# EAGLE design backpack_v1.1 (EAGLE 6.6.0)
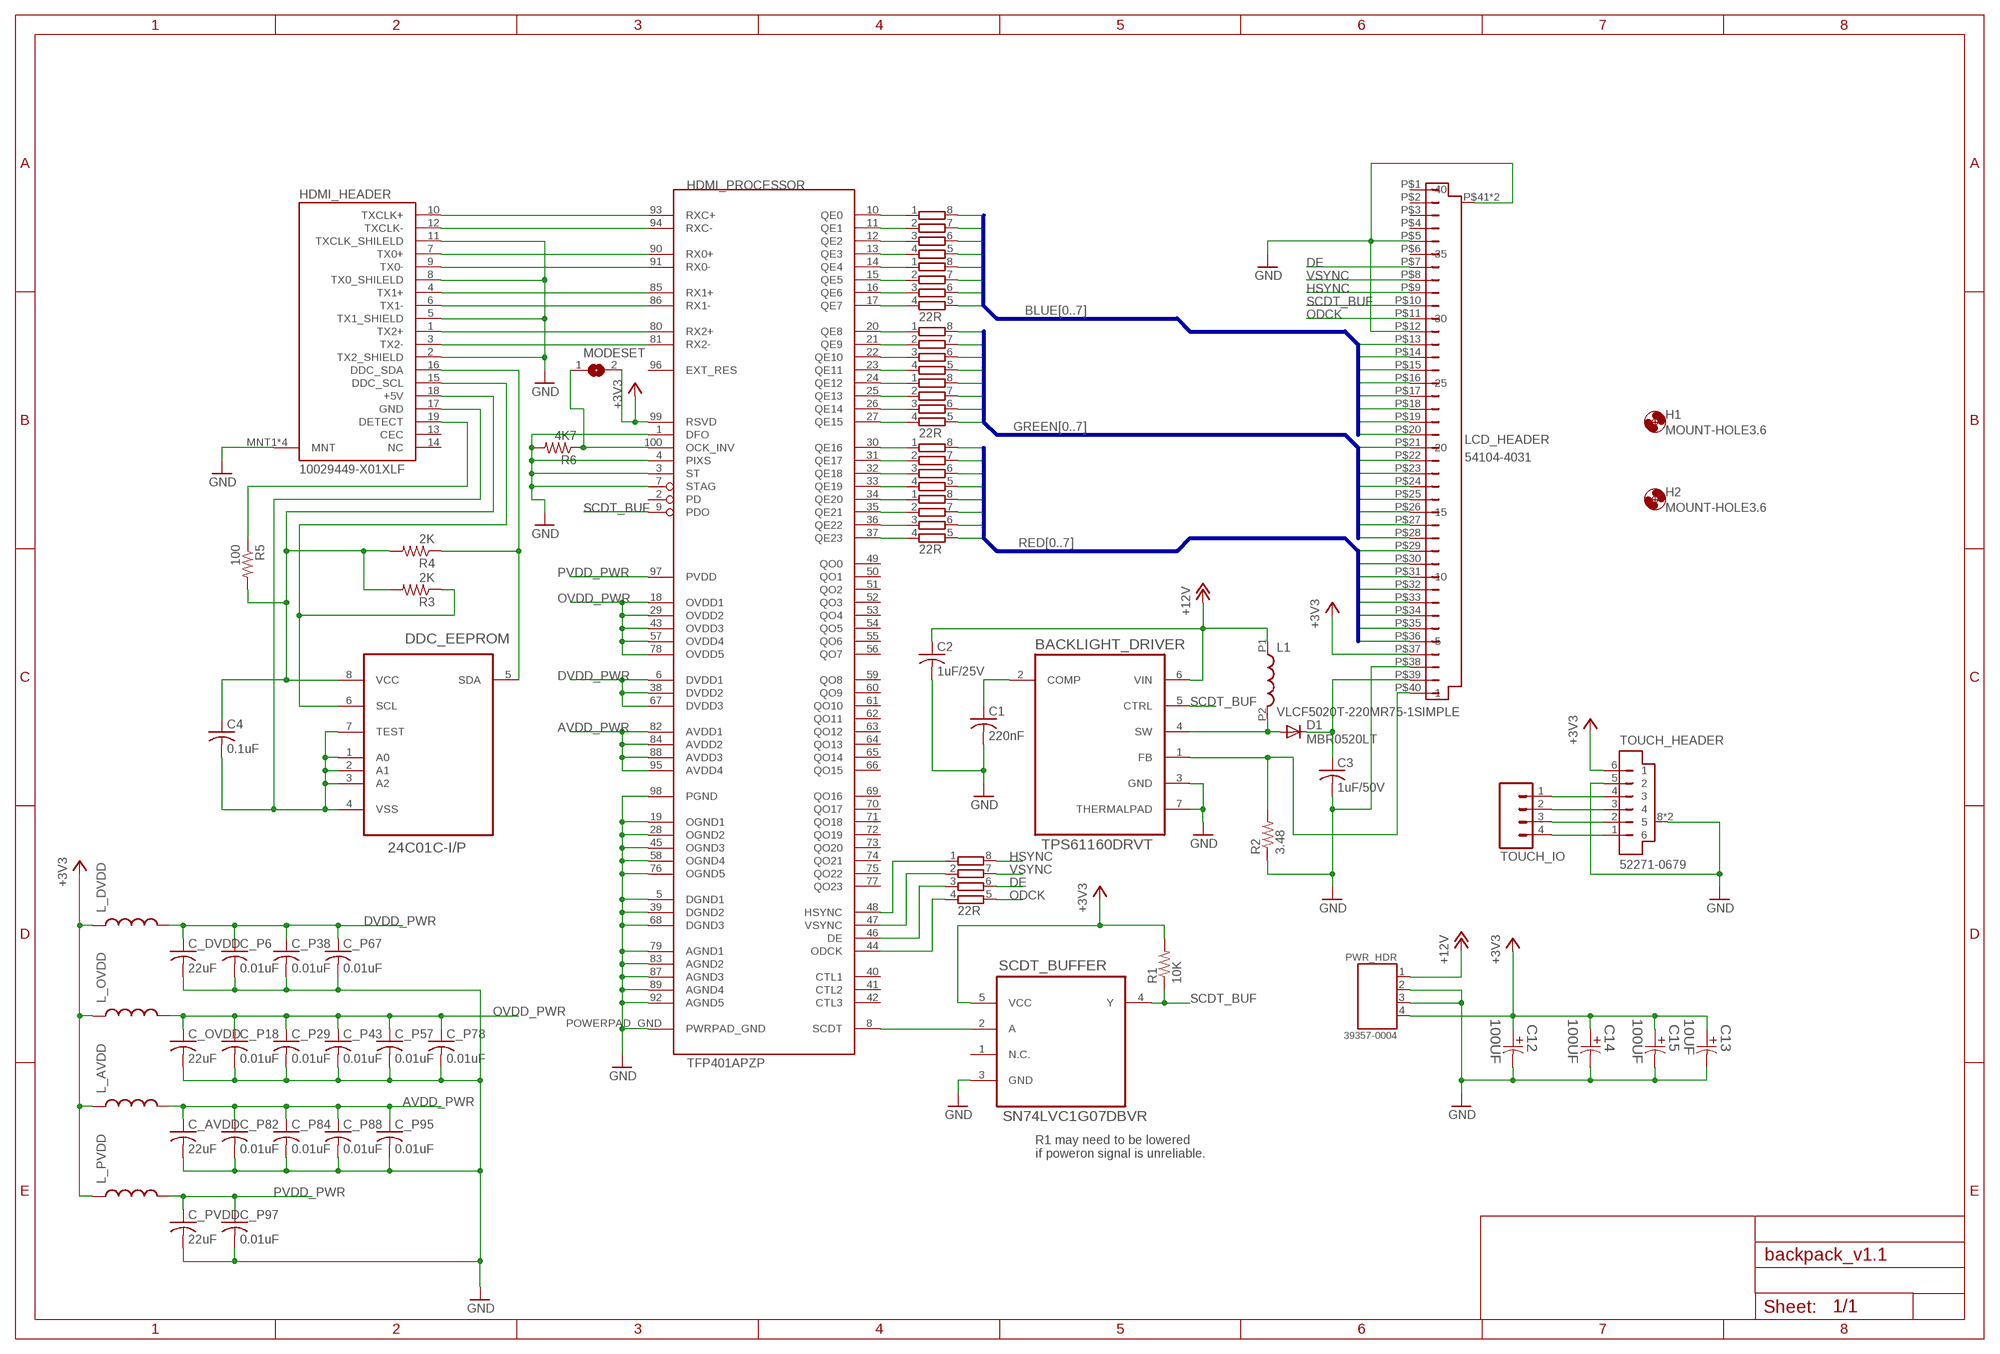
[diagram p0: schematic, sheet 1]

## Parts
BACKLIGHT_DRIVER  TPS61160DRVT  [SON65P210X210X80-7N]
C1  220nF  C-USC0805  [C0805]
C2  1uF/25V  C-USC0603  [C0603]
C3  1uF/50V  C-USC0805  [C0805]
C4  0.1uF  C-USC0603  [C0603]
C12  100UF  ECE-A1CKS101-D8XP3.5  [CAPPR350-800X1150]
C13  10UF  ECE-A1CKS100-D4XP1.5  [CAPPR150-400X700]
C14  100UF  ECE-A1CKS101-D8XP3.5  [CAPPR350-800X1150]
C15  100UF  ECE-A1CKS101-D8XP3.5  [CAPPR350-800X1150]
C_AVDD  22uF  C-USC0603  [C0603]
C_DVDD  22uF  C-USC0603  [C0603]
C_OVDD  22uF  C-USC0603  [C0603]
C_P6  0.01uF  C-USC0603  [C0603]
C_P18  0.01uF  C-USC0603  [C0603]
C_P29  0.01uF  C-USC0603  [C0603]
C_P38  0.01uF  C-USC0603  [C0603]
C_P43  0.01uF  C-USC0603  [C0603]
C_P57  0.01uF  C-USC0603  [C0603]
C_P67  0.01uF  C-USC0603  [C0603]
C_P78  0.01uF  C-USC0603  [C0603]
C_P82  0.01uF  C-USC0603  [C0603]
C_P84  0.01uF  C-USC0603  [C0603]
C_P88  0.01uF  C-USC0603  [C0603]
C_P95  0.01uF  C-USC0603  [C0603]
C_P97  0.01uF  C-USC0603  [C0603]
C_PVDD  22uF  C-USC0603  [C0603]
D1  MBR0520LT  [SOD123]
DDC_EEPROM  24C01C-I/P  [DIP254P762X533-8]
H1  MOUNT-HOLE3.6  [3,6]
H2  MOUNT-HOLE3.6  [3,6]
HDMI_HEADER  10029449-X01XLF  [10029449]
HDMI_PROCESSOR  TFP401APZP  [100-TQFP(PZP)]
L1  VLCF5020T-220MR75-1SIMPLE  [VLCF5020-1_SIMPLE]
L_AVDD  INDUCTOR0603  [0603]
L_DVDD  INDUCTOR0603  [0603]
L_OVDD  INDUCTOR0603  [0603]
L_PVDD  INDUCTOR0603  [0603]
LCD_HEADER  54104-4031  [54104-4031]
MODESET  SJ  [SJ]
PWR_HDR  39357-0004  [39357-0004]
R1  10K  R-US_R0805  [R0805]
R2  3.48  R-US_R0805  [R0805]
R3  2K  R-US_R0805  [R0805]
R4  2K  R-US_R0805  [R0805]
R5  100  R-US_R0805  [R0805]
R6  4K7  R-US_R0805  [R0805]
RN1  22R  4R-NCAY16  [CAY16]
RN2  22R  4R-NCAY16  [CAY16]
RN3  22R  4R-NCAY16  [CAY16]
RN4  22R  4R-NCAY16  [CAY16]
RN5  22R  4R-NCAY16  [CAY16]
RN6  22R  4R-NCAY16  [CAY16]
RN7  22R  4R-NCAY16  [CAY16]
SCDT_BUFFER  SN74LVC1G07DBVR  [SOT95P280X145-5N]
TOUCH_HEADER  52271-0679  [52271-0679]
TOUCH_IO  M04POLAR  [MOLEX-1X4]

## Nets
+3V3: C12.1 C13.1 C14.1 C15.1 HDMI_PROCESSOR.99(RSVD) L_AVDD.1 L_DVDD.1 L_OVDD.1 L_PVDD.1 LCD_HEADER.P$37 MODESET.2 PWR_HDR.4 R1.2 SCDT_BUFFER.5(VCC) TOUCH_HEADER.6
+5V: C4.1 DDC_EEPROM.8(VCC) HDMI_HEADER.18(+5V) R3.2 R4.2 R5.2
+12V: BACKLIGHT_DRIVER.6(VIN) C2.1 L1.P1 PWR_HDR.1
AVDD_PWR: C_AVDD.1 C_P82.1 C_P84.1 C_P88.1 C_P95.1 HDMI_PROCESSOR.82(AVDD1) HDMI_PROCESSOR.84(AVDD2) HDMI_PROCESSOR.88(AVDD3) HDMI_PROCESSOR.95(AVDD4) L_AVDD.2
BLUE0: LCD_HEADER.P$20 RN1.8
BLUE1: LCD_HEADER.P$19 RN1.7
BLUE2: LCD_HEADER.P$18 RN1.6
BLUE3: LCD_HEADER.P$17 RN1.5
BLUE4: LCD_HEADER.P$16 RN2.8
BLUE5: LCD_HEADER.P$15 RN2.7
BLUE6: LCD_HEADER.P$14 RN2.6
BLUE7: LCD_HEADER.P$13 RN2.5
DDC_SCL: DDC_EEPROM.6(SCL) HDMI_HEADER.15(DDC_SCL) R3.1
DDC_SDA: DDC_EEPROM.5(SDA) HDMI_HEADER.16(DDC_SDA) R4.1
DE: LCD_HEADER.P$7 RN7.6
DVDD_PWR: C_DVDD.1 C_P6.1 C_P38.1 C_P67.1 HDMI_PROCESSOR.6(DVDD1) HDMI_PROCESSOR.38(DVDD2) HDMI_PROCESSOR.67(DVDD3) L_DVDD.2
GND: BACKLIGHT_DRIVER.3(GND) BACKLIGHT_DRIVER.7(THERMALPAD) C1.2 C2.2 C3.2 C12.2 C13.2 C14.2 C15.2 C_AVDD.2 C_DVDD.2 C_OVDD.2 C_P6.2 C_P18.2 C_P29.2 C_P38.2 C_P43.2 C_P57.2 C_P67.2 C_P78.2 C_P82.2 C_P84.2 C_P88.2 C_P95.2 C_P97.2 C_PVDD.2 HDMI_HEADER.2(TX2_SHIELD) HDMI_HEADER.5(TX1_SHIELD) HDMI_HEADER.8(TX0_SHILELD) HDMI_HEADER.11(TXCLK_SHILELD) HDMI_HEADER.MNT1(MNT) HDMI_HEADER.MNT2(MNT) HDMI_HEADER.MNT3(MNT) HDMI_HEADER.MNT4(MNT) HDMI_PROCESSOR.1(DFO) HDMI_PROCESSOR.3(ST) HDMI_PROCESSOR.4(PIXS) HDMI_PROCESSOR.5(DGND1) HDMI_PROCESSOR.7(STAG) HDMI_PROCESSOR.19(OGND1) HDMI_PROCESSOR.28(OGND2) HDMI_PROCESSOR.39(DGND2) HDMI_PROCESSOR.45(OGND3) HDMI_PROCESSOR.58(OGND4) HDMI_PROCESSOR.68(DGND3) HDMI_PROCESSOR.76(OGND5) HDMI_PROCESSOR.79(AGND1) HDMI_PROCESSOR.83(AGND2) HDMI_PROCESSOR.87(AGND3) HDMI_PROCESSOR.89(AGND4) HDMI_PROCESSOR.92(AGND5) HDMI_PROCESSOR.98(PGND) HDMI_PROCESSOR.POWERPAD_GND(PWRPAD_GND) LCD_HEADER.P$5 LCD_HEADER.P$12 LCD_HEADER.P$38 LCD_HEADER.P$41(GND) LCD_HEADER.P$42(GND) PWR_HDR.2 PWR_HDR.3 R2.1 R6.2 SCDT_BUFFER.3(GND) TOUCH_HEADER.5 TOUCH_HEADER.8(GND) TOUCH_HEADER.9(GND)
GREEN0: LCD_HEADER.P$28 RN3.8
GREEN1: LCD_HEADER.P$27 RN3.7
GREEN2: LCD_HEADER.P$26 RN3.6
GREEN3: LCD_HEADER.P$25 RN3.5
GREEN4: LCD_HEADER.P$24 RN4.8
GREEN5: LCD_HEADER.P$23 RN4.7
GREEN6: LCD_HEADER.P$22 RN4.6
GREEN7: LCD_HEADER.P$21 RN4.5
HDMI_DETECT: HDMI_HEADER.19(DETECT) R5.1
HDMI_GND: C4.2 DDC_EEPROM.1(A0) DDC_EEPROM.2(A1) DDC_EEPROM.3(A2) DDC_EEPROM.4(VSS) DDC_EEPROM.7(TEST) HDMI_HEADER.17(GND)
HSYNC: LCD_HEADER.P$9 RN7.8
N$1: HDMI_PROCESSOR.10(QE0) RN1.1
N$2: HDMI_PROCESSOR.11(QE1) RN1.2
N$3: HDMI_PROCESSOR.12(QE2) RN1.3
N$4: HDMI_PROCESSOR.13(QE3) RN1.4
N$5: HDMI_PROCESSOR.14(QE4) RN2.1
N$6: HDMI_PROCESSOR.15(QE5) RN2.2
N$7: HDMI_PROCESSOR.16(QE6) RN2.3
N$8: HDMI_PROCESSOR.17(QE7) RN2.4
N$9: HDMI_PROCESSOR.20(QE8) RN3.1
N$10: HDMI_PROCESSOR.21(QE9) RN3.2
N$11: HDMI_PROCESSOR.22(QE10) RN3.3
N$12: HDMI_PROCESSOR.23(QE11) RN3.4
N$13: HDMI_PROCESSOR.24(QE12) RN4.1
N$14: HDMI_PROCESSOR.25(QE13) RN4.2
N$15: HDMI_PROCESSOR.26(QE14) RN4.3
N$16: HDMI_PROCESSOR.27(QE15) RN4.4
N$17: HDMI_PROCESSOR.30(QE16) RN5.1
N$18: HDMI_PROCESSOR.31(QE17) RN5.2
N$19: HDMI_PROCESSOR.32(QE18) RN5.3
N$20: HDMI_PROCESSOR.33(QE19) RN5.4
N$21: HDMI_PROCESSOR.34(QE20) RN6.1
N$22: HDMI_PROCESSOR.35(QE21) RN6.2
N$23: HDMI_PROCESSOR.36(QE22) RN6.3
N$24: HDMI_PROCESSOR.37(QE23) RN6.4
N$25: BACKLIGHT_DRIVER.4(SW) D1.A L1.P2
N$26: BACKLIGHT_DRIVER.2(COMP) C1.1
N$27: BACKLIGHT_DRIVER.1(FB) LCD_HEADER.P$40 R2.2
N$28: HDMI_PROCESSOR.44(ODCK) RN7.4
N$29: C3.1 D1.C LCD_HEADER.P$39
N$30: HDMI_PROCESSOR.46(DE) RN7.3
N$31: HDMI_PROCESSOR.47(VSYNC) RN7.2
N$32: HDMI_PROCESSOR.48(HSYNC) RN7.1
N$33: TOUCH_HEADER.4 TOUCH_IO.1
N$34: TOUCH_HEADER.3 TOUCH_IO.2
N$35: TOUCH_HEADER.2 TOUCH_IO.3
N$36: TOUCH_HEADER.1 TOUCH_IO.4
OCK_INV: HDMI_PROCESSOR.100(OCK_INV) MODESET.1 R6.1
ODCK: LCD_HEADER.P$11 RN7.5
OVDD_PWR: C_OVDD.1 C_P18.1 C_P29.1 C_P43.1 C_P57.1 C_P78.1 HDMI_PROCESSOR.18(OVDD1) HDMI_PROCESSOR.29(OVDD2) HDMI_PROCESSOR.43(OVDD3) HDMI_PROCESSOR.57(OVDD4) HDMI_PROCESSOR.78(OVDD5) L_OVDD.2
PVDD_PWR: C_P97.1 C_PVDD.1 HDMI_PROCESSOR.97(PVDD) L_PVDD.2
RED0: LCD_HEADER.P$36 RN5.8
RED1: LCD_HEADER.P$35 RN5.7
RED2: LCD_HEADER.P$34 RN5.6
RED3: LCD_HEADER.P$33 RN5.5
RED4: LCD_HEADER.P$32 RN6.8
RED5: LCD_HEADER.P$31 RN6.7
RED6: LCD_HEADER.P$30 RN6.6
RED7: LCD_HEADER.P$29 RN6.5
SCDT: HDMI_PROCESSOR.8(SCDT) SCDT_BUFFER.2(A)
SCDT_BUF: BACKLIGHT_DRIVER.5(CTRL) HDMI_PROCESSOR.9(PDO) LCD_HEADER.P$10 R1.1 SCDT_BUFFER.4(Y)
TX0_N: HDMI_HEADER.9(TX0-) HDMI_PROCESSOR.91(RX0-)
TX0_P: HDMI_HEADER.7(TX0+) HDMI_PROCESSOR.90(RX0+)
TX1_N: HDMI_HEADER.6(TX1-) HDMI_PROCESSOR.86(RX1-)
TX1_P: HDMI_HEADER.4(TX1+) HDMI_PROCESSOR.85(RX1+)
TX2_N: HDMI_HEADER.3(TX2-) HDMI_PROCESSOR.81(RX2-)
TX2_P: HDMI_HEADER.1(TX2+) HDMI_PROCESSOR.80(RX2+)
TXCLK_N: HDMI_HEADER.12(TXCLK-) HDMI_PROCESSOR.94(RXC-)
TXCLK_P: HDMI_HEADER.10(TXCLK+) HDMI_PROCESSOR.93(RXC+)
VSYNC: LCD_HEADER.P$8 RN7.7
Unconnected: HDMI_HEADER.13(CEC) HDMI_HEADER.14(NC) HDMI_PROCESSOR.2(PD) HDMI_PROCESSOR.40(CTL1) HDMI_PROCESSOR.41(CTL2) HDMI_PROCESSOR.42(CTL3) HDMI_PROCESSOR.49(QO0) HDMI_PROCESSOR.50(QO1) HDMI_PROCESSOR.51(QO2) HDMI_PROCESSOR.52(QO3) HDMI_PROCESSOR.53(QO4) HDMI_PROCESSOR.54(QO5) HDMI_PROCESSOR.55(QO6) HDMI_PROCESSOR.56(QO7) HDMI_PROCESSOR.59(QO8) HDMI_PROCESSOR.60(QO9) HDMI_PROCESSOR.61(QO10) HDMI_PROCESSOR.62(QO11) HDMI_PROCESSOR.63(QO12) HDMI_PROCESSOR.64(QO13) HDMI_PROCESSOR.65(QO14) HDMI_PROCESSOR.66(QO15) HDMI_PROCESSOR.69(QO16) HDMI_PROCESSOR.70(QO17) HDMI_PROCESSOR.71(QO18) HDMI_PROCESSOR.72(QO19) HDMI_PROCESSOR.73(QO20) HDMI_PROCESSOR.74(QO21) HDMI_PROCESSOR.75(QO22) HDMI_PROCESSOR.77(QO23) HDMI_PROCESSOR.96(EXT_RES) LCD_HEADER.P$1 LCD_HEADER.P$2 LCD_HEADER.P$3 LCD_HEADER.P$4 LCD_HEADER.P$6 SCDT_BUFFER.1(N.C.)

## Buses
BLUE[0..7]
GREEN[0..7]
RED[0..7]

## Notes on the sheet
- R1 may need to be lowered 
  if poweron signal is unreliable.

## Library data of the parts
BACKLIGHT_DRIVER = newark-TI-TPS61160:TPS61160DRVT: White LED Driver With Digital and PWM Brightness Control in 2mm x 2mm QFN Package for up to 10 LEDs in Series; MPN: TPS61160DRVT; OC_FARNELL: 1603420; OC_NEWARK: 65M6336; PACKAGE: SON-6; SUPPLIER: Texas Instruments
C1-C4 C_AVDD C_DVDD C_OVDD C_P6 C_P18 C_P29 C_P38 C_P43 C_P57 C_P67 C_P78 C_P82 C_P84 C_P88 C_P95 C_P97 C_PVDD = resistor:C-US: CAPACITOR, American symbol
C12 C14 C15 = newark-Panasonic-ECE:ECE-: Aluminum Electrolytic Capacitors/Radial Lead Type; MPN: ECE-A1CKS101; OC_FARNELL: 1902001; OC_NEWARK: 55T0219; PACKAGE: Radial Lead-TH; SUPPLIER: PANASONIC; TOLERANCE: ±20 %; VOLTAGERATING: 16V
C13 = newark-Panasonic-ECE:ECE-: Aluminum Electrolytic Capacitors/Radial Lead Type; MPN: ECE-A1CKS100; OC_FARNELL: 1901997; OC_NEWARK: 55T0218; PACKAGE: Radial Lead-TH; SUPPLIER: PANASONIC; TOLERANCE: ±20 %; VOLTAGERATING: 16V
D1 = diode:MBR0520LT: SCHOTTKY BARRIER RECTIFIER Source: http://onsemi.com .. MBR0520LT1-D.pdf
DDC_EEPROM = newark-Microchip-24C01CIP:24C01C-I/P: IC EEPROM 1KBIT 400KHZ,DIP-8; MPN: 24C01C-I/P; OC_FARNELL: 1847800; OC_NEWARK: 92C6948; PACKAGE: DIP-8; SUPPLIER: Microchip
H1 H2 = holes:MOUNT-HOLE: MOUNTING HOLE with drill center marker
HDMI_HEADER = ccbtech-FCI:10029449-X01XLF
HDMI_PROCESSOR = ccbtech-TI:TFP401A
L1 = ccbtech-TDK:VLCF5020T-220MR75-1
L_AVDD L_DVDD L_OVDD L_PVDD = SparkFun-Passives:INDUCTOR: Inductors Basic Inductor/Choke - 0603 and 1206. Footprints are not proven and vary greatly between part numbers.
LCD_HEADER = ccbtech-Molex:54104-4031
MODESET = jumper:SJ: SMD solder JUMPER
PWR_HDR = ccbtech-Molex:39357-0004
R1-R6 = resistor:R-US_: RESISTOR, American symbol
RN1-RN7 = resistor-dil:4R-N: Array Chip Resistor Source: RS Component / Phycomp; OC_FARNELL: unknown; OC_NEWARK: unknown
SCDT_BUFFER = newark-TI-SN74LVC1G07:SN74LVC1G07DBVR: SINGLE BUFFER/DRIVER WITH OPEN-DRAIN OUTPUT; MPN: SN74LVC1G07DBVR; OC_FARNELL: 1102969; OC_NEWARK: 39C2931; PACKAGE: SOT-23-5; SUPPLIER: Texas Instruments
TOUCH_HEADER = ccbtech-Molex:52271-0679
TOUCH_IO = SparkFun-Connectors:M04: Header 4 Standard 4-pin 0.1" header. Use with straight break away headers (SKU : PRT-00116), right angle break away headers (PRT-00553), swiss pins (PRT-00743), machine pins (PRT-00117), and female headers (PRT-00115). Molex polarized connector foot print use with SKU : PRT-08231 with associated crimp pins and housings. 1MM SMD Version SKU: PRT-10208

## Board
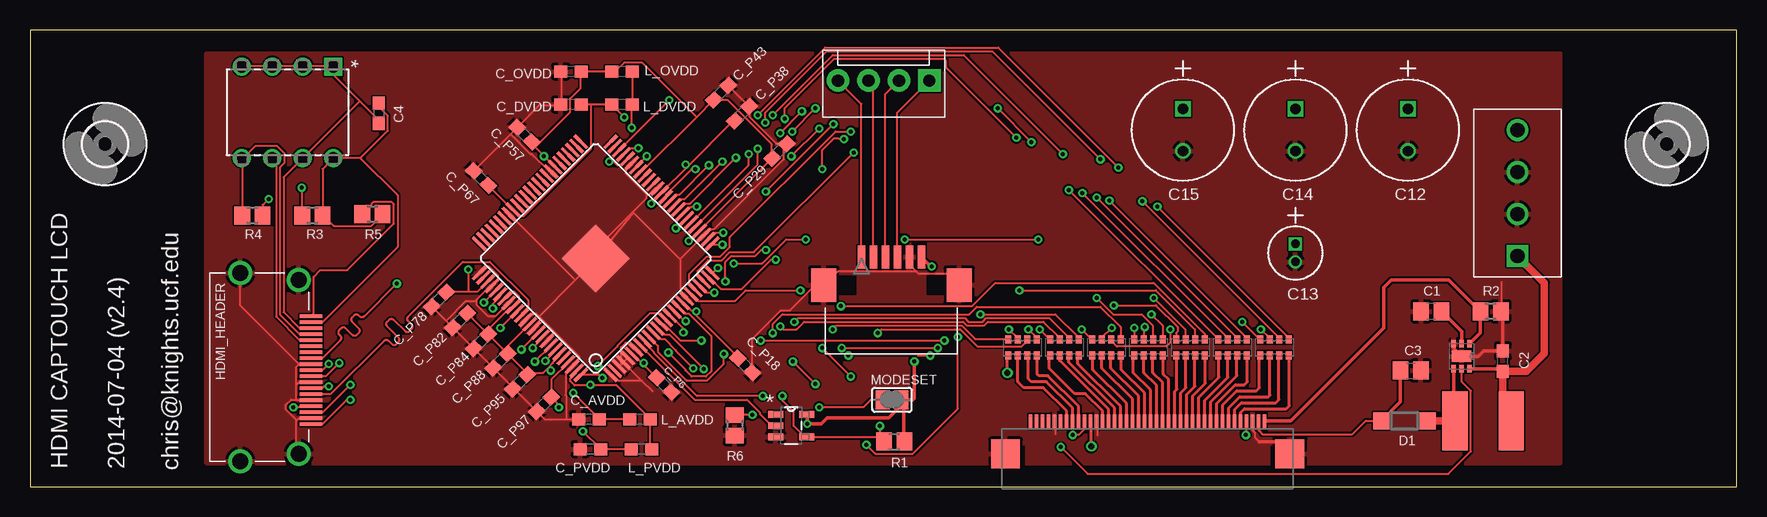
[diagram p1: board, top side]
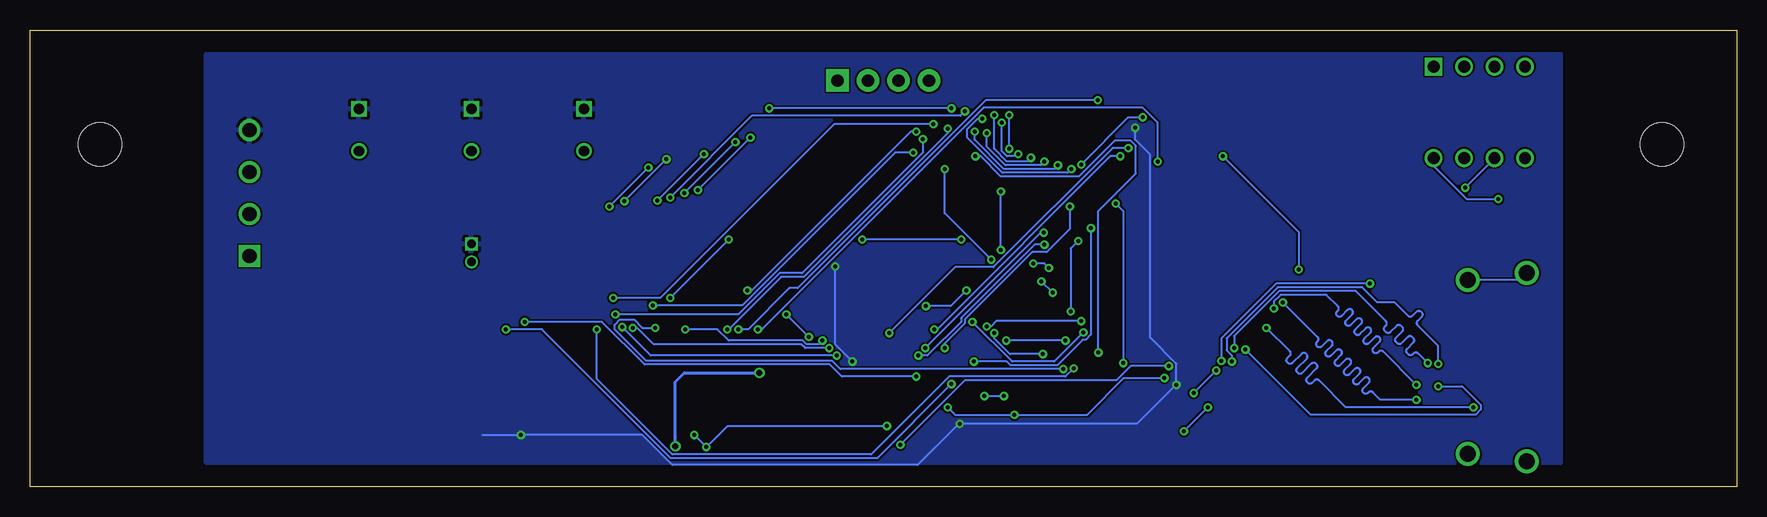
[diagram p2: board, bottom side, seen from below]

Size 142.24 x 38.1 mm. Coordinates in mm from the lower left corner, seen from the top.
Outline: 0,0 142.24,0 142.24,38.1 0,38.1 0,0
Copper layers (1*16): Top 0.0356mm / dielectric 1.5011mm / Bottom 0.0356mm
Design rules "LaenPCBOrder": minimum track width 6mil, minimum drill 13mil, track to track 6mil, track to pad 6mil, pad to pad 6mil, via to via 6mil, smd to smd 6mil, copper to edge 15mil, drill to drill 6mil, minimum pad ring 7mil, minimum via ring 7mil, stop-mask expansion 3mil, vias tented up to drill 0mil, thermal gap 10mil

### Footprints (pad centres in the part's own frame; a part is rotated, then mirrored left to right if it is on the bottom)
SON65P210X210X80-7N = smd 0.61 x 0.356: 1 -1.041,0.66; 2 -1.041,0; 3 -1.041,-0.66; 4 1.041,-0.66; 5 1.041,0; 6 1.041,0.66 | smd 0.991 x 1.6: 7 0,0
C0805 = smd 1.3 x 1.5: 1 -0.85,0; 2 0.85,0
C0603 = smd 1.1 x 1: 1 -0.85,0; 2 0.85,0
CAPPR350-800X1150 = drill 0.864 square: 1 -3.505,0 | drill 0.864: 2 0,0
CAPPR150-400X700 = drill 0.711 square: 1 -1.499,0 | drill 0.711: 2 0,0
SOD123 = smd 1.4 x 1.4: A 1.9,0; C -1.9,0
DIP254P762X533-8 = drill 0.991 square: 1 -7.62,7.62 | drill 0.991: 2 -7.62,5.08; 3 -7.62,2.54; 4 -7.62,0; 5 0,0; 6 0,2.54; 7 0,5.08; 8 0,7.62
3,6 = hole 3.6: 0,0
10029449 = smd 0.3 x 1.9: 1 4.75,0.95; 2 4.25,0.95; 3 3.75,0.95; 4 3.25,0.95; 5 2.75,0.95; 6 2.25,0.95; 7 1.75,0.95; 8 1.25,0.95; 9 0.75,0.95; 10 0.25,0.95; 11 -0.25,0.95; 12 -0.75,0.95; 13 -1.25,0.95; 14 -1.75,0.95; 15 -2.25,0.95; 16 -2.75,0.95; 17 -3.25,0.95; 18 -3.75,0.95; 19 -4.25,0.95 | drill 1.33: MNT1 -7.25,-0.05; MNT2 -7.85,-4.95; MNT3 7.85,-4.95; MNT4 7.25,-0.05
100-TQFP(PZP) = smd 0.27 x 1.5: 1 -6,-7.75; 2 -5.5,-7.75; 3 -5,-7.75; 4 -4.5,-7.75; 5 -4,-7.75; 6 -3.5,-7.75; 7 -3,-7.75; 8 -2.5,-7.75; 9 -2,-7.75; 10 -1.5,-7.75; 11 -1,-7.75; 12 -0.5,-7.75; 13 0,-7.75; 14 0.5,-7.75; 15 1,-7.75; 16 1.5,-7.75; 17 2,-7.75; 18 2.5,-7.75; 19 3,-7.75; 20 3.5,-7.75; 21 4,-7.75; 22 4.5,-7.75; 23 5,-7.75; 24 5.5,-7.75; 25 6,-7.75; 51 6,7.75; 52 5.5,7.75; 53 5,7.75; 54 4.5,7.75; 55 4,7.75; 56 3.5,7.75; 57 3,7.75; 58 2.5,7.75; 59 2,7.75; 60 1.5,7.75; 61 1,7.75; 62 0.5,7.75; 63 0,7.75; 64 -0.5,7.75; 65 -1,7.75; 66 -1.5,7.75; 67 -2,7.75; 68 -2.5,7.75; 69 -3,7.75; 70 -3.5,7.75; 71 -4,7.75; 72 -4.5,7.75; 73 -5,7.75; 74 -5.5,7.75; 75 -6,7.75 | smd 1.5 x 0.27: 26 7.75,-6; 27 7.75,-5.5; 28 7.75,-5; 29 7.75,-4.5; 30 7.75,-4; 31 7.75,-3.5; 32 7.75,-3; 33 7.75,-2.5; 34 7.75,-2; 35 7.75,-1.5; 36 7.75,-1; 37 7.75,-0.5; 38 7.75,0; 39 7.75,0.5; 40 7.75,1; 41 7.75,1.5; 42 7.75,2; 43 7.75,2.5; 44 7.75,3; 45 7.75,3.5; 46 7.75,4; 47 7.75,4.5; 48 7.75,5; 49 7.75,5.5; 50 7.75,6; 76 -7.75,6; 77 -7.75,5.5; 78 -7.75,5; 79 -7.75,4.5; 80 -7.75,4; 81 -7.75,3.5; 82 -7.75,3; 83 -7.75,2.5; 84 -7.75,2; 85 -7.75,1.5; 86 -7.75,1; 87 -7.75,0.5; 88 -7.75,0; 89 -7.75,-0.5; 90 -7.75,-1; 91 -7.75,-1.5; 92 -7.75,-2; 93 -7.75,-2.5; 94 -7.75,-3; 95 -7.75,-3.5; 96 -7.75,-4; 97 -7.75,-4.5; 98 -7.75,-5; 99 -7.75,-5.5; 100 -7.75,-6 | smd 4 x 4: POWERPAD_GND 0,0
VLCF5020-1_SIMPLE = smd 4.9 x 2.1: P1 0,2.35; P2 0,-2.35
0603 = smd 1.1 x 1: 1 -0.85,0; 2 0.85,0
54104-4031 = smd 0.3 x 1.2: P$1 0,-0.603; P$2 0.5,-0.603; P$3 1,-0.603; P$4 1.5,-0.603; P$5 2,-0.603; P$6 2.5,-0.603; P$7 3,-0.603; P$8 3.5,-0.603; P$9 4,-0.603; P$10 4.5,-0.603; P$11 5,-0.603; P$12 5.5,-0.603; P$13 6,-0.603; P$14 6.5,-0.603; P$15 7,-0.603; P$16 7.5,-0.603; P$17 8,-0.603; P$18 8.5,-0.603; P$19 9,-0.603; P$20 9.5,-0.603; P$21 10,-0.603; P$22 10.5,-0.603; P$23 11,-0.603; P$24 11.5,-0.603; P$25 12,-0.603; P$26 12.5,-0.603; P$27 13,-0.603; P$28 13.5,-0.603; P$29 14,-0.603; P$30 14.5,-0.603; P$31 15,-0.603; P$32 15.5,-0.603; P$33 16,-0.603; P$34 16.5,-0.603; P$35 17,-0.603; P$36 17.5,-0.603; P$37 18,-0.603; P$38 18.5,-0.603; P$39 19,-0.603; P$40 19.5,-0.603 | smd 2.4 x 2.4: P$41 -2.1,-3.303; P$42 21.6,-3.303
SJ = smd 1.168 x 1.6: 1 -0.762,0; 2 0.762,0
39357-0004 = drill 1.2 square: 1 5.25,0 | drill 1.2: 2 1.75,0; 3 -1.75,0; 4 -5.25,0
R0805 = smd 1.3 x 1.5: 1 -0.85,0; 2 0.85,0
CAY16 = smd 0.5 x 0.65: 1 -1.2,-0.675; 2 -0.4,-0.675; 3 0.4,-0.675; 4 1.2,-0.675; 5 1.2,0.675; 6 0.4,0.675; 7 -0.4,0.675; 8 -1.2,0.675
SOT95P280X145-5N = smd 1.27 x 0.559: 1 -1.295,0.94; 2 -1.295,0; 3 -1.295,-0.94; 4 1.295,-0.94; 5 1.295,0.94
52271-0679 = smd 0.6 x 1.9: 1 0,0.938; 2 -1,0.938; 3 -2,0.938; 4 -3,0.938; 5 -4,0.938; 6 -5,0.938 | smd 2.1 x 2.8: 8 -8.15,3.288; 9 3.15,3.288
MOLEX-1X4 = drill 1.016 pad 1.88 square: 1 0,0 | drill 1.016 pad 1.88: 2 2.54,0; 3 5.08,0; 4 7.62,0

### Placement (x,y rotation side)
BACKLIGHT_DRIVER  119.29,10.89 270 top
C1  116.78,14.63 180 top
C2  122.74,10.48 90 top
C3  115.06,9.69 0 top
C4  29.06,31.16 270 top
C12  114.83,28 270 top
C13  105.45,18.75 270 top
C14  105.45,28 270 top
C15  96.08,28 270 top
C_AVDD  46.58,5.62 180 top
C_DVDD  45.08,31.88 180 top
C_OVDD  45.08,34.62 180 top
C_P6  52.83,8.5 315 top
C_P18  59.58,10.12 315 top
C_P29  62.45,28 45 top
C_P38  59.33,31.12 45 top
C_P43  57.58,32.88 45 top
C_P57  41.2,29.38 135 top
C_P67  37.58,25.75 135 top
C_P78  34.08,15.62 225 top
C_P82  35.83,13.88 225 top
C_P84  37.58,12.12 225 top
C_P88  39.2,10.5 225 top
C_P95  40.83,8.75 225 top
C_P97  42.83,6.88 225 top
C_PVDD  46.7,3.12 180 top
D1  114.53,5.51 0 top
DDC_EEPROM  17.66,27.43 270 top
H1  6.25,28.57 0 top
H2  136.39,28.57 0 top
HDMI_HEADER  22.46,9.98 270 top
HDMI_PROCESSOR  47.14,19.05 45 top
L1  121.09,5.49 270 top
L_AVDD  50.83,5.62 180 top
L_DVDD  49.33,31.88 180 top
L_OVDD  49.33,34.62 180 top
L_PVDD  50.95,3.12 180 top
LCD_HEADER  83.39,6.05 0 top
MODESET  71.83,7.25 0 top
PWR_HDR  123.95,24.5 270 top
R1  72.02,3.77 0 top
R2  121.72,14.63 180 top
R3  23.53,22.64 0 top
R4  18.53,22.63 0 top
R5  28.53,22.75 0 top
R6  58.72,5.12 270 top
RN1  89.7,11.62 180 top
RN2  86.2,11.62 180 top
RN3  96.7,11.62 180 top
RN4  93.2,11.62 180 top
RN5  103.7,11.62 180 top
RN6  100.2,11.62 180 top
RN7  82.7,11.62 180 top
SCDT_BUFFER  63.44,5.09 0 top
TOUCH_HEADER  69.29,20.1 180 top
TOUCH_IO  74.95,33.88 180 top

### Tracks (layer width: path | path; a pad name or v marks a point on that pad's centre or on a via)
+3V3  (via drill 0.33)
  Top 0.152: v101.33,4.31 101.39,4.38 101.39,5.44 LCD_HEADER.P$37 | 64.76,6 SCDT_BUFFER.5 64.76,5.94 | 73.08,7.25 MODESET.2 72.83,6.94 | 72.83,3.81 R1.2 | 74.33,19.12 TOUCH_HEADER.6 | L_OVDD.1 50.2,34.62 50.2,31.88 L_DVDD.1 50.14,31.81 v50.14,29.94 | L_PVDD.1 51.76,3.12 51.7,3.19 51.7,5.62 L_AVDD.1 51.64,5.69 48.89,8.44 46.7,8.44 | 46.7,8.44 45.39,8.44 45.01,8.81 45.01,9 45.51,9.5 45.51,9.62 HDMI_PROCESSOR.99 | v46.7,8.5 46.7,8.44
  Top 0.305: 72.83,6.94 72.83,3.81 | 74.33,19.12 75.08,18.38 v75.14,18.38 | v73.7,10.44 73.7,7.38 73.58,7.25 73.08,7.25 71.58,5.75 66.45,5.75 65.95,5.25 v64.76,5.25 64.76,5.94
  Bottom 0.152: 104.51,4.31 v101.33,4.31 91.2,4.31 88.7,1.81 68.26,1.81 64.83,5.25 v64.76,5.25 50.01,5.25 46.76,8.5 v46.7,8.5 46.7,10.25 48.89,12.44 48.89,27.69 50.14,28.94 v50.14,29.94 | v75.14,18.38 75.14,11.88 v73.7,10.44
  pour Bottom: 14.7,2 127.54,2 127.54,36.1 14.7,36.1
+5V  (via drill 0.33)
  Top 0.152: 27.57,27.44 29.82,29.69 29.82,30.94 29.07,31.69 29.07,32 C4.1 | 27.57,27.44 25.32,27.44 DDC_EEPROM.8 25.26,27.38 24.39,26.5 24.39,22.69 R3.2 24.45,22.62 25.32,21.75 28.45,21.75 29.32,22.62 29.32,22.75 R5.2 | v19.89,24 19.39,23.5 19.39,22.69 R4.2 | HDMI_HEADER.18 23.45,13.75 24.39,13.75 30.64,20 30.64,24.31 27.57,27.38 27.57,27.44
  Bottom 0.152: v19.89,24 22.51,24 25.26,26.75 25.26,27.38 DDC_EEPROM.8
+12V
  Top 0.152: 122.83,9.94 C2.1
  Top 0.305: 122.74,5.49 L1.P1 | C2.1 122.74,9.85 BACKLIGHT_DRIVER.6
  Top 0.61: C2.1 122.74,5.49 | C2.1 124.7,9.62 126.2,11.12 126.2,17 PWR_HDR.1
AVDD_PWR  (via drill 0.33)
  Top 0.152: L_AVDD.2 C_AVDD.1 47.39,5.69 v45.26,7.81 | C_P88.1 39.76,11.12 38.2,12.69 C_P84.1 | C_P88.1 39.83,11.06 41.39,9.5 41.39,9.38 C_P95.1 41.45,9.5 42.76,9.5 43.17,9.91 | C_P82.1 36.45,14.44 38.14,12.75 C_P84.1 | 43.17,9.91 43.58,10.31 43.58,10.38 44.14,10.94 44.14,11.06 HDMI_PROCESSOR.95 | HDMI_PROCESSOR.88 41.64,13.56 39.51,11.44 C_P88.1 | C_P84.1 38.01,12.94 40.01,14.94 40.2,14.94 HDMI_PROCESSOR.84 40.33,15 40.76,15.44 40.76,15.88 40.39,16.25 40.26,16.25 39.76,15.75 39.58,15.75 HDMI_PROCESSOR.82 | 43.17,9.91 v43.39,9.69
  Bottom 0.152: v43.39,9.69 v45.26,7.81
BLUE0
  Top 0.254: LCD_HEADER.P$20 92.89,7.81 90.95,9.75 90.95,10.9 RN1.8
BLUE1
  Top 0.254: LCD_HEADER.P$19 92.39,7.56 90.08,9.88 90.08,10.93 RN1.7
BLUE2
  Top 0.254: LCD_HEADER.P$18 91.89,7.31 89.33,9.88 89.33,10.93 RN1.6
BLUE3
  Top 0.254: LCD_HEADER.P$17 91.39,6.93 88.58,9.75 88.58,10.88 RN1.5
BLUE4
  Top 0.254: LCD_HEADER.P$16 90.89,6.68 87.33,10.25 87.33,10.88 RN2.8
BLUE5
  Top 0.254: LCD_HEADER.P$15 90.39,6.56 86.58,10.38 86.58,10.93 RN2.7
BLUE6
  Top 0.254: LCD_HEADER.P$14 89.89,6.43 85.8,10.53 RN2.6
BLUE7
  Top 0.254: LCD_HEADER.P$13 89.39,6.31 87.95,7.75 87.08,7.75 84.95,9.88 84.95,10.9 RN2.5
DDC_SCL  (via drill 0.33)
  Top 0.152: v22.64,24.94 22.64,22.69 R3.1 | HDMI_HEADER.15 23.39,12.25 22.45,12.25 20.51,14.19 20.51,27.06 20.2,27.38 DDC_EEPROM.6
  Bottom 0.152: v22.64,24.94 20.2,27.38 DDC_EEPROM.6
DDC_SDA
  Top 0.152: R4.1 17.7,22.69 17.7,27.38 DDC_EEPROM.5 17.76,27.38 18.82,28.44 20.57,28.44 21.2,27.81 21.2,27 20.82,26.62 20.82,14.38 22.45,12.75 23.39,12.75 HDMI_HEADER.16
DE
  Top 0.254: LCD_HEADER.P$7 86.39,6.31 84.45,8.25 82.83,8.25 82.33,8.75 82.33,10.93 RN7.6
DVDD_PWR  (via drill 0.33)
  Top 0.152: 46.76,31.88 L_DVDD.2 48.51,31.81 v49.51,30.81 | 46.76,31.88 C_DVDD.1 | 38.2,25.12 40.2,23.12 HDMI_PROCESSOR.67 40.33,23.12 40.89,22.56 41.14,22.56 46.76,28.19 46.76,31.88 | 51.11,10.22 50.2,11.12 HDMI_PROCESSOR.6 | 51.11,10.22 52.2,9.12 C_P6.1 | 54.79,26.72 52.64,24.56 HDMI_PROCESSOR.38 52.64,24.5 v51.76,23.62 | 54.79,26.72 58.58,30.5 58.7,30.5 C_P38.1 | v51.14,10.31 51.14,10.25 51.11,10.22 | 54.79,26.72 v54.64,26.88 | 38.2,25.12 | 38.2,25.12 C_P67.1
  Bottom 0.152: v51.14,10.31 51.14,23 v51.76,23.62 | v49.51,30.81 50.7,30.81 v54.64,26.88
GND
  Top 0.152: 122.64,17.06 122.64,14.75 R2.1 | 73.86,17.97 74.08,17.75 76.45,17.75 77.39,16.81 TOUCH_HEADER.8 | 73.86,17.97 73.33,18.5 73.33,19.12 TOUCH_HEADER.5 | 73.86,17.97 73.83,17.94 67.33,17.94 66.2,16.81 TOUCH_HEADER.9 65.45,16.81 63.33,14.69 62.58,14.69 60.2,12.31 60.2,9.56 C_P18.2 | 49.45,10.38 50.98,8.84 | 50.98,8.84 51.89,7.94 | 53.39,7.94 C_P6.2 | HDMI_PROCESSOR.1 48.39,9.31 48.58,9.31 49.08,8.81 50.95,8.81 50.98,8.84 | 49.45,10.38 49.29,10.22 | 49.29,10.22 49.14,10.06 HDMI_PROCESSOR.3 | 49.45,10.38 49.76,10.69 HDMI_PROCESSOR.5 | 49.45,10.38 HDMI_PROCESSOR.4 | HDMI_PROCESSOR.7 50.45,11.5 50.26,11.5 49.76,12 49.64,12 49.26,11.62 49.26,10.25 49.29,10.22 | 62.51,4.19 62.2,4.19 SCDT_BUFFER.3 | 22.23,5.53 22.2,5.5 22.2,2.94 22.39,2.75 HDMI_HEADER.MNT4 | 22.23,5.53 22.39,5.69 23.39,5.69 HDMI_HEADER.2 | 22.2,7.25 21.76,7.25 21.32,6.81 21.32,6.44 22.23,5.53 | 22.2,7.25 23.39,7.25 HDMI_HEADER.5 | 22.23,8.53 22.2,8.5 22.2,7.25 | 22.23,8.53 22.39,8.69 23.39,8.69 HDMI_HEADER.8 | 22.39,10.19 23.39,10.19 HDMI_HEADER.11 | 22.39,10.19 22.2,10 22.2,8.56 22.23,8.53 | HDMI_HEADER.MNT2 17.51,17.81 17.51,15.12 22.39,10.25 22.39,10.19 | HDMI_PROCESSOR.76 37.45,17.88 37.64,17.88 38.14,18.38 38.26,18.38 39.01,17.62 39.01,17.31 38.51,16.81 HDMI_PROCESSOR.79 38.45,16.81 37.2,15.56 37.2,15.5 | 37.2,15.5 37.2,15.19 38.14,14.25 38.83,14.25 39.89,15.31 HDMI_PROCESSOR.83 | 34.67,13.84 33.51,15 C_P78.2 | 34.67,13.84 35.2,13.31 C_P82.2 35.26,13.25 36.95,11.56 C_P84.2 37.01,11.5 38.58,9.94 C_P88.2 38.64,9.88 40.2,8.31 40.2,8.19 C_P95.2 40.26,8.25 42.2,6.31 C_P97.2 42.26,6.25 42.89,5.62 43.39,5.62
  Top 0.152: 43.39,5.62 44.7,5.62 | 44.7,5.62 C_AVDD.2 | 45.83,3.12 C_PVDD.2 45.89,3.06 | 43.39,5.56 43.39,5.62 | 37.2,15.5 36.33,15.5 34.67,13.84 | C_OVDD.2 44.26,34.62 44.26,31.88 C_DVDD.2 44.2,31.81 42.45,31.81 40.64,30 C_P57.2 40.58,29.94 40.04,29.41 | 40.04,29.41 37.01,26.38 C_P67.2 | 40.04,29.41 41.7,27.75 41.83,27.75 43.26,26.31 43.39,26.31 HDMI_PROCESSOR.58 | C_P43.2 58.2,33.44 59.89,31.75 C_P38.2 59.95,31.69 59.95,30.88 62.2,28.62 63.01,28.62 C_P29.2 62.83,28.56 62.83,27.31 57.01,21.5 56.7,21.5 56.2,21 HDMI_PROCESSOR.28 56.14,20.94 54.2,19 | 42.58,14 42.58,14.06 42.42,14.22 | 42.58,14 42.58,13.94 42.08,13.44 42.08,13.25 HDMI_PROCESSOR.89 | 42.42,14.22 42.2,14.44 41.83,14.44 41.33,13.94 HDMI_PROCESSOR.87 | 43.64,12.94 43.64,13 42.64,14 42.58,14 | 43.64,12.94 43.64,12.88 43.14,12.38 43.14,12.19 HDMI_PROCESSOR.92 | 43.64,12.94 43.7,12.94 45.76,10.88 45.76,10.75 45.26,10.25 45.26,10.06 HDMI_PROCESSOR.98 45.14,10 44.64,9.5 44.64,7.62 44.7,7.56 44.7,5.62 | 54.2,19 54.2,16.38 54.7,15.88 54.7,15.75 HDMI_PROCESSOR.19 | 51.39,24.38 51.58,24.38 52.08,24.88 HDMI_PROCESSOR.39 | 51.39,24.38 49.64,26.12 49.64,26.5 50.14,27 HDMI_PROCESSOR.45 | 51.39,24.38 51.39,24.06 47.2,19.88 47.2,19.06 HDMI_PROCESSOR.POWERPAD_GND | 54.2,19 54.14,19 50.26,22.88 HDMI_PROCESSOR.POWERPAD_GND | 45.45,17.25 47.2,19 HDMI_PROCESSOR.POWERPAD_GND | 45.45,17.25 42.42,14.22 | 45.45,17.25 39.95,22.75 HDMI_PROCESSOR.68 | 45.45,17.25 HDMI_PROCESSOR.POWERPAD_GND | LCD_HEADER.P$38 101.89,4.68 102.08,4.5 102.08,4.12 102.45,3.75 | 104.45,3.75 104.58,3.62 104.58,2.76 104.59,2.75 | LCD_HEADER.P$12 88.95,5.45 88.95,4.25
  Top 0.152: LCD_HEADER.P$5 85.45,5.45 85.45,4.38
  Top 0.305: BACKLIGHT_DRIVER.3 118.63,11.55 BACKLIGHT_DRIVER.7 119.31,10.88 120.7,10.88 121.16,11.33 C2.2 122.74,14.46 R2.1 | 102.45,3.75 104.45,3.75
  Bottom 0.152: HDMI_HEADER.MNT1 22.39,17.25 18.07,17.25 17.51,17.81 HDMI_HEADER.MNT2
  pour Top: 14.7,2 127.54,2 127.54,36.1 14.7,36.1
GREEN0
  Top 0.254: LCD_HEADER.P$28 96.89,7.57 97.95,8.62 97.95,10.9 RN3.8
GREEN1
  Top 0.254: LCD_HEADER.P$27 96.39,7.69 97.08,8.38 97.08,10.93 RN3.7
GREEN2
  Top 0.254: LCD_HEADER.P$26 95.89,7.82 96.33,8.25 96.33,10.93 RN3.6
GREEN3
  Top 0.254: LCD_HEADER.P$25 95.39,7.94 95.58,8.12 95.58,10.88 RN3.5
GREEN4
  Top 0.254: LCD_HEADER.P$24 94.89,8.94 94.45,9.38 94.45,10.9 RN4.8
GREEN5
  Top 0.254: LCD_HEADER.P$23 94.39,8.69 93.58,9.5 93.58,10.93 RN4.7
GREEN6
  Top 0.254: LCD_HEADER.P$22 93.89,8.44 92.83,9.5 92.83,10.93 RN4.6
GREEN7
  Top 0.254: LCD_HEADER.P$21 93.39,8.06 91.95,9.5 91.95,10.9 RN4.5
HDMI_DETECT
  Top 0.152: R5.1 27.7,22.75 28.45,23.5 28.45,23.56 28.64,23.75 30.14,23.75 30.32,23.56 30.32,21.94 26.45,18.06 24.2,18.06 23.64,17.5 23.64,14.44 23.45,14.25 HDMI_HEADER.19
HDMI_GND
  Top 0.152: DDC_EEPROM.4 17.7,35.06 20.14,35.06 DDC_EEPROM.3 20.26,35.06 22.7,35.06 DDC_EEPROM.2 22.76,35.06 25.2,35.06 DDC_EEPROM.1 25.32,35 25.32,34.31 27.48,32.16 | 27.48,32.16 29.01,30.62 29.01,30.31 C4.2 | HDMI_HEADER.17 23.39,13.25 22.45,13.25 21.14,14.56 21.14,25.81 22.7,27.38 DDC_EEPROM.7 22.76,27.44 27.48,32.16
HSYNC
  Top 0.254: LCD_HEADER.P$9 87.39,6.68 84.83,9.25 84.08,9.25 83.95,9.38 83.95,10.9 RN7.8
N$1  (via drill 0.33)
  Top 0.152: v61.89,12.81 61.89,13.56 62.7,14.38 78.26,14.38 78.89,15 89.2,15 90.89,13.31 90.89,12.31 RN1.1 | v57.83,11.06 57.83,10.25 56.45,8.88 54.7,8.88 52.33,11.25 52.33,11.75 51.58,12.5 HDMI_PROCESSOR.10
  Bottom 0.152: v61.89,12.81 61.89,12.38 60.58,11.06 v57.83,11.06
N$2  (via drill 0.33)
  Top 0.152: v95.01,13.12 95.01,12 94.7,11.69 90.58,11.69 90.14,12.12 90.14,12.25 RN1.2 | v55.26,9.88 53.83,11.31 53.83,11.38 52.89,12.31 52.45,12.31 51.95,12.81 HDMI_PROCESSOR.11
  Bottom 0.152: v95.01,13.12 95.01,9 88.7,2.69 72.14,2.69 65.64,9.19 55.95,9.19 v55.26,9.88
N$3  (via drill 0.33)
  Top 0.152: v90.14,13.25 89.33,12.44 89.33,12.31 RN1.3 | v56.14,9.81 53.26,12.69 52.83,12.69 52.33,13.19 HDMI_PROCESSOR.12
  Bottom 0.152: v90.14,13.25 91.2,13.25 91.89,13.94 93.08,13.94 93.51,13.5 93.51,13.12 90.89,10.5 75.39,10.5 74.7,9.81 v56.14,9.81
N$4  (via drill 0.33)
  Top 0.152: v87.64,13.12 88.45,12.31 RN1.4 | v60.89,12.19 v76.2,12.19 | v55.95,12.19 54.2,12.19 52.83,13.56 HDMI_PROCESSOR.13
  Bottom 0.152: v87.64,13.12 84.95,13.12 84.01,12.19 77.83,12.19 77.51,11.88 76.51,11.88 v76.2,12.19 | v55.95,12.19 v60.89,12.19
N$5  (via drill 0.33)
  Top 0.152: v79.2,14.38 85.45,14.38 87.39,12.44 87.39,12.31 RN2.1 | v77.33,12.5 77.33,6.5 73.58,2.75 70.45,2.75 v69.7,3.5 | v47.33,10.06 48.95,11.69 48.95,11.75 51.64,14.44 52.45,14.44 52.95,13.94 HDMI_PROCESSOR.14
  Bottom 0.152: v77.33,12.5 v79.2,14.38 | v69.7,3.5 64.33,8.88 51.7,8.88 50.51,10.06 v47.33,10.06
N$6  (via drill 0.33)
  Top 0.152: v63.7,13.75 64.01,14.06 77.89,14.06 78.2,13.75 79.39,13.75 79.7,14.06 84.95,14.06 86.58,12.44 86.58,12.31 RN2.2 | v54.45,12.88 54.45,13.19 53.39,14.25 HDMI_PROCESSOR.15
  Bottom 0.152: v63.7,13.75 60.39,10.44 56.89,10.44 v54.45,12.88
N$7  (via drill 0.33)
  Top 0.152: v62.51,13.38 62.76,13.12 63.89,13.12 64.51,13.75 77.76,13.75 78.08,13.44 79.51,13.44 79.83,13.75 84.45,13.75 85.76,12.44 85.76,12.31 RN2.3 | v54.64,13.81 54.51,13.81 HDMI_PROCESSOR.16
  Bottom 0.152: v62.51,13.38 62.14,13.38 61.7,13.81 v54.64,13.81
N$8  (via drill 0.33)
  Top 0.152: v84.14,13.12 84.95,12.31 RN2.4 | v63.45,27.56 v65.76,29.88 | v53.2,11.19 54.64,9.75 54.64,9.69 55.14,9.19 56.33,9.19 56.76,9.62 56.76,12.56 54.89,14.44 54.58,14.44 54.08,14.94 HDMI_PROCESSOR.17
  Bottom 0.152: v84.14,13.12 84.01,13.12 79.64,17.5 77.76,17.5 65.76,29.5 v65.76,29.88 | v63.45,27.56 63.01,27.56 61.33,25.88 54.83,25.88 51.83,28.88 50.51,28.88 50.08,28.44 50.08,26.12 53.2,23 v53.2,11.19
N$9  (via drill 0.33)
  Top 0.152: v67.58,15.06 78.51,15.06 80.45,17 93.64,17 97.89,12.75 97.89,12.31 RN3.1 | v64.2,16.38 59.64,16.38 58.76,15.5 55.64,15.5 55.14,16 HDMI_PROCESSOR.20
  Bottom 0.152: v67.58,15.06 65.51,15.06 v64.2,16.38
N$10  (via drill 0.33)
  Top 0.152: v82.45,16.38 93.83,16.38 97.08,13.12 97.08,12.31 RN3.2 | v68.39,29.62 67.14,29.62 58.33,20.81 58.33,20 57.51,19.19 56.39,19.19 54.95,17.75 54.95,16.94 55.45,16.44 HDMI_PROCESSOR.21
  Bottom 0.152: v82.45,16.38 82.08,16.38 68.83,29.62 v68.39,29.62
N$11  (via drill 0.33)
  Top 0.152: v93.64,15.75 96.26,13.12 96.26,12.31 RN3.3 | v61.33,24.62 v66.95,30.25 | v61.33,19.75 60.95,19.75 60.45,19.25 58.45,19.25 57.95,18.75 v57.95,17.12 | v57.01,16.19 56.39,16.19 55.83,16.75 HDMI_PROCESSOR.22
  Bottom 0.152: v93.64,15.75 89.7,15.75 75.2,30.25 v66.95,30.25 | v61.33,19.75 v61.33,24.62 | v57.01,16.19 v57.95,17.12
N$12  (via drill 0.33)
  Top 0.152: v90.33,15.12 93.83,15.12 95.64,13.31 95.64,12.94 95.51,12.81 95.51,12.31 RN3.4 | v68.64,27.88 60.33,19.56 58.33,19.56 57.64,18.88 56.51,18.88 55.64,18 55.64,17.62 56.14,17.12 HDMI_PROCESSOR.23
  Bottom 0.152: v90.33,15.12 82.89,15.12 70.14,27.88 v68.64,27.88
N$13  (via drill 0.33)
  Top 0.152: v93.45,14.38 94.39,13.44 94.39,12.31 RN4.1 | v67.83,29 67.45,29 67.39,29.06 67.01,29.06 66.01,28.06 v66.01,26.5 | v62.14,18.94 61.76,18.94 59.33,16.5 57.58,16.5 56.58,17.5 HDMI_PROCESSOR.24
  Bottom 0.152: v93.45,14.38 83.2,14.38 79.76,17.81 77.89,17.81 67.83,27.88 v67.83,29 | v66.01,26.5 66.01,22.81 v62.14,18.94
N$14  (via drill 0.33)
  Top 0.152: v88.89,15.75 90.26,14.38 92.64,14.38 93.58,13.44 93.58,12.31 RN4.2 | v72.89,20.62 v84.01,20.62 | v64.64,20.62 63.01,20.62 61.01,18.62 v58.64,18.62 | v57.33,18.25 56.89,17.81 HDMI_PROCESSOR.25
  Bottom 0.152: v84.01,20.62 v88.89,15.75 | v64.64,20.62 v72.89,20.62 | v58.64,18.62 57.7,18.62 v57.33,18.25
N$15  (via drill 0.33)
  Top 0.152: v92.89,13.31 92.83,13.25 92.83,12.31 RN4.3 | v75.01,10.94 74.01,10.94 73.89,11.06 68.33,11.06 v68.2,10.94 | v57.7,20.19 56.95,20.19 56.89,20.25 HDMI_PROCESSOR.26
  Bottom 0.152: v92.89,13.31 90.51,10.94 v75.01,10.94 | v68.2,10.94 67.45,10.94 64.64,13.75 64.64,14.06 58.51,20.19 v57.7,20.19
N$16  (via drill 0.33)
  Top 0.152: v92.01,13.25 92.01,12.31 RN4.4 | v67.64,11.56 v75.64,11.56 | v57.76,21.19 57.08,21.19 56.58,20.69 HDMI_PROCESSOR.27
  Bottom 0.152: v92.01,13.25 91.64,13.25 90.26,11.88 77.95,11.88 77.64,11.56 v75.64,11.56 | v67.64,11.56 58.01,21.19 v57.76,21.19
N$17  (via drill 0.33)
  Top 0.152: 104.89,12.44 104.89,12.31 RN5.1 104.9,12.43 v93.95,23.38 | v60.64,31 66.26,36.62 80.7,36.62 v90.7,26.62 | v60.64,28.19 60.64,26.88 55.51,21.75 HDMI_PROCESSOR.30
  Bottom 0.152: v60.64,28.19 v60.64,31 | v90.7,26.62 v93.95,23.38
N$18  (via drill 0.33)
  Top 0.152: 104.08,12.44 104.08,12.31 RN5.2 104.1,12.41 v92.7,23.81 | v61.26,30.38 61.26,31.19 66.39,36.31 80.2,36.31 v89.2,27.31 | v59.89,27.75 59.89,26.81 55.14,22.06 HDMI_PROCESSOR.31
  Bottom 0.152: v61.26,30.38 61.26,28 60.83,27.56 60.08,27.56 v59.89,27.75 | v89.2,27.31 v92.7,23.81
N$19  (via drill 0.33)
  Top 0.152: v102.58,13.12 103.26,12.44 103.26,12.31 RN5.3 | v63.58,10.44 v65.45,8.56 | v53.83,21.56 54.7,22.44 HDMI_PROCESSOR.32
  Bottom 0.152: v102.58,13.12 99.58,13.12 88.83,2.38 71.64,2.38 v65.45,8.56 | v63.58,10.44 60.83,10.44 60.51,10.12 56.64,10.12 54.51,12.25 54.26,12.25 53.83,12.69 v53.83,21.56
N$20  (via drill 0.33)
  Top 0.152: v101.01,13.75 102.45,12.31 RN5.4 | v66.01,11.56 v68.39,9.19 | v55.58,23.38 55.2,23.38 55.14,23.31 54.95,23.31 54.45,22.81 HDMI_PROCESSOR.33
  Bottom 0.152: v101.01,13.75 94.58,13.75 91.01,10.19 75.58,10.19 74.58,9.19 v68.39,9.19 | v66.01,11.56 66.01,11.94 64.33,13.62 64.33,13.94 58.7,19.56 57.51,19.56 55.58,21.5 v55.58,23.38
N$21  (via drill 0.33)
  Top 0.152: 101.39,12.44 101.39,12.31 RN6.1 101.4,12.43 v89.95,23.88 | v61.89,31 66.89,36 77.83,36 v86.08,27.75 | v58.83,27.44 55.01,23.62 54.58,23.62 54.08,23.12 HDMI_PROCESSOR.34
  Bottom 0.152: v61.89,31 61.89,28.19 60.83,27.12 59.14,27.12 v58.83,27.44 | v86.08,27.75 v89.95,23.88
N$22  (via drill 0.33)
  Top 0.152: 100.58,12.44 100.58,12.31 RN6.2 100.6,12.41 v88.89,24.12 | v62.51,29.5 v64.33,31.31 | v57.7,27.12 54.58,24 54.2,24 53.7,23.5 HDMI_PROCESSOR.35
  Bottom 0.152: v64.33,31.31 64.7,30.94 82.08,30.94 v88.89,24.12 | v62.51,29.5 62.51,28.38 60.95,26.81 58.01,26.81 v57.7,27.12
N$23  (via drill 0.33)
  Top 0.152: 99.76,12.44 99.76,12.31 RN6.3 99.8,12.4 v87.7,24.5 | v63.51,29.62 v65.45,31.56 | v56.58,26.81 54.14,24.38 53.89,24.38 53.39,23.88 HDMI_PROCESSOR.36 | v80.64,31.56 v83.45,28.75
  Bottom 0.152: v65.45,31.56 v80.64,31.56 | v63.51,29.62 63.51,28.94 61.08,26.5 56.89,26.5 v56.58,26.81 | v83.45,28.75 v87.7,24.5
N$24  (via drill 0.33)
  Top 0.152: 98.95,12.44 98.95,12.31 RN6.4 99,12.32 v86.58,24.75 | v62.89,30.69 62.89,31.56 67.01,35.69 76.14,35.69 76.33,35.5 76.33,35 v82.2,29.12 | v55.45,26.5 55.14,26.5 53.01,24.38 53.01,24.19 HDMI_PROCESSOR.37
  Bottom 0.152: v62.89,30.69 63.26,30.69 64.14,29.81 64.14,29.12 61.2,26.19 55.76,26.19 v55.45,26.5 | v82.2,29.12 v86.58,24.75
N$25
  Top 0.305: BACKLIGHT_DRIVER.4 118.63,5.49 L1.P2 | D1.A 116.42,5.49
  Top 0.61: 116.42,5.49 L1.P2
N$26
  Top 0.305: BACKLIGHT_DRIVER.2 119.29,12.96 C1.1
N$27
  Top 0.152: 102.95,5.5 LCD_HEADER.P$40 | 120.76,14.69 R2.2
  Top 0.305: BACKLIGHT_DRIVER.1 120.87,12.85 R2.2 118.25,17.25 113.45,17.25 112.83,16.62 112.83,13.25 105.08,5.5 102.95,5.5
N$28  (via drill 0.33)
  Top 0.152: v66.89,13.12 67.2,13.44 77.64,13.44 78.76,12.31 81.45,12.31 RN7.4 | v51.39,27.56 50.51,26.69 HDMI_PROCESSOR.44
  Bottom 0.152: v66.89,13.12 66.64,13.12 52.2,27.56 v51.39,27.56
N$29
  Top 0.152: LCD_HEADER.P$39 102.39,4.68 102.7,4.38 110.2,4.38 111.33,5.5 D1.C
  Top 0.305: C3.1 114.21,7.09 D1.C
N$30  (via drill 0.33)
  Top 0.152: v81.58,13.12 82.26,12.44 82.26,12.31 RN7.3 | v48.26,27.12 48.64,27.12 48.95,26.81 49.26,26.81 49.76,27.31 HDMI_PROCESSOR.46
  Bottom 0.152: v81.58,13.12 81.26,13.12 62.76,31.62 49.51,31.62 48.26,30.38 v48.26,27.12
N$31  (via drill 0.33)
  Top 0.152: v70.64,12.81 70.95,13.12 77.51,13.12 78.95,11.69 82.64,11.69 83.08,12.12 83.08,12.25 RN7.2 | v50.7,28.25 49.95,28.25 49.45,27.75 HDMI_PROCESSOR.47
  Bottom 0.152: v70.64,12.81 65.14,18.31 61.95,18.31 52.01,28.25 v50.7,28.25
N$32  (via drill 0.33)
  Top 0.152: v83.2,13.12 83.89,12.44 83.89,12.31 RN7.1 | v53.26,32.25 49.14,28.12 HDMI_PROCESSOR.48
  Bottom 0.152: v83.2,13.12 82.39,13.12 78.95,16.56 78.26,16.56 62.58,32.25 v53.26,32.25
N$33
  Top 0.152: TOUCH_HEADER.4 72.29,31.21 TOUCH_IO.1
N$34
  Top 0.152: TOUCH_HEADER.3 71.29,32.76 TOUCH_IO.2
N$35
  Top 0.152: TOUCH_HEADER.2 70.29,33.45 TOUCH_IO.3
N$36
  Top 0.152: TOUCH_HEADER.1 69.29,31.91 TOUCH_IO.4
OCK_INV  (via drill 0.33)
  Top 0.152: v60.2,6 58.76,6 R6.1 | MODESET.1 70.08,7.25 69.45,6.62 v65.76,6.62 | v47.7,9.06 47.45,9.31 45.95,9.31 HDMI_PROCESSOR.100
  Bottom 0.152: v65.76,6.62 65.14,6 v60.2,6 54.14,6 51.08,9.06 v47.7,9.06
ODCK  (via drill 0.5)
  Top 0.245: LCD_HEADER.P$11 88.39,3.44 v88.45,3.38
  Top 0.254: v81.45,9.5 81.45,10.9 RN7.5
  Bottom 0.245: v88.45,3.38 88.45,4.12
  Bottom 0.254: 88.45,4.12 88.45,8.75 87.7,9.5 v81.45,9.5
OVDD_PWR  (via drill 0.33)
  Top 0.152: 36.51,16.25 37.26,16.25 38.08,17.06 HDMI_PROCESSOR.78 | 36.51,16.25 34.7,16.25 C_P78.1 | 42.86,27.59 43.76,26.69 HDMI_PROCESSOR.57 | 42.86,27.59 41.83,28.62 41.83,28.75 C_P57.1 42.14,28.38 45.01,31.25 45.01,32.38 45.89,33.25 45.89,34.56 C_OVDD.1 L_OVDD.2 48.51,34.69 48.83,34.69 49.51,35.38 51.01,35.38 55.54,30.84 | v36.51,18.12 36.51,16.25 | v42.83,27.56 42.86,27.59 | 55.36,14.47 54.45,15.38 HDMI_PROCESSOR.18 | 55.36,14.47 58.95,10.88 58.95,10.75 C_P18.1 | 55.54,30.84 C_P43.1 57.01,32.25 58.14,32.25 61.83,28.56 61.83,27.44 C_P29.1 55.83,21.38 HDMI_PROCESSOR.29 55.76,21.38 v54.89,20.5 | 55.54,30.84 51.01,26.31 50.89,26.31 HDMI_PROCESSOR.43 | v55.51,14.62 55.36,14.47
  Bottom 0.152: v36.51,18.12 36.51,21.25 v42.83,27.56 | v55.51,14.62 55.51,19.88 v54.89,20.5
PVDD_PWR  (via drill 0.33)
  Top 0.152: L_PVDD.2 C_PVDD.1 47.51,3.19 v46.08,4.62 | HDMI_PROCESSOR.97 44.89,10.38 43.45,8.94 43.45,7.5 C_P97.1 43.45,7.44 44.08,6.81 v44.08,6.62
  Bottom 0.152: v44.08,6.62 v46.08,4.62
RED0
  Top 0.254: LCD_HEADER.P$36 100.89,6.19 101.2,6.5 104.7,6.5 104.95,6.75 104.95,10.9 RN5.8
RED1
  Top 0.254: LCD_HEADER.P$35 100.39,6.44 100.95,7 103.83,7 104.08,7.25 104.08,10.93 RN5.7
RED2
  Top 0.254: LCD_HEADER.P$34 99.89,6.57 100.83,7.5 103.2,7.5 103.33,7.62 103.33,10.93 RN5.6
RED3
  Top 0.254: LCD_HEADER.P$33 99.39,6.82 100.58,8 102.2,8 102.45,8.25 102.45,10.9 RN5.5
RED4
  Top 0.254: LCD_HEADER.P$32 98.89,6.94 100.45,8.5 101.2,8.5 101.45,8.75 101.45,10.9 RN6.8
RED5
  Top 0.254: LCD_HEADER.P$31 98.39,7.07 100.58,9.25 100.58,10.93 RN6.7
RED6
  Top 0.254: LCD_HEADER.P$30 97.89,7.19 99.83,9.12 99.83,10.93 RN6.6
RED7
  Top 0.254: LCD_HEADER.P$29 97.39,7.44 99.08,9.12 99.08,10.88 RN6.5
SCDT
  Top 0.152: SCDT_BUFFER.2 62.14,5.12 61.76,5.12 60.83,6.06 60.83,6.19 59.76,7.25 55.39,7.25 50.89,11.75 HDMI_PROCESSOR.8
SCDT_BUF  (via drill 0.33)
  Top 0.152: v61.08,7.56 55.58,7.56 52.01,11.12 52.01,11.19 51.26,11.94 51.26,12.12 HDMI_PROCESSOR.9 | v62.7,7.56 62.7,7.19 63.64,6.25 63.64,5.06 64.51,4.19 64.7,4.19 SCDT_BUFFER.4 64.76,4.12 70.83,4.12 71.14,3.81 R1.1 70.83,4.19 v70.83,5.06 | v85.89,3.31 88.14,1.06 118.2,1.06 120.08,2.94 120.08,8 119.33,8.75 119.33,9.81 BACKLIGHT_DRIVER.5 | v86.89,4.31 87.39,4.31 87.89,4.81 87.89,5.44 LCD_HEADER.P$10
  Bottom 0.152: v62.7,7.56 v61.08,7.56 | v86.89,4.31 v85.89,3.31 85.83,3.31 84.08,5.06 v70.83,5.06
TX0_N  (via drill 0.33)
  Top 0.152: v41.89,11.56 42.7,12.38 42.7,12.5 HDMI_PROCESSOR.91 | v25.76,10.31 24.7,9.25 23.45,9.25 HDMI_HEADER.9
  Bottom 0.152: v41.89,11.56 41.89,12.56 38.14,16.31 31.76,16.31 29.26,13.81 arc90 29.26,13.44 29.33,13.37 arc-90 29.33,12.99 29.25,12.9 arc-90 28.87,12.9 28.35,13.42 arc90 27.98,13.42 27.89,13.33 arc90 27.89,12.95 28.4,12.44 arc-90 28.4,12.06 28.32,11.98 arc-90 27.94,11.98 27.43,12.49 arc90 27.05,12.49 26.96,12.4 arc90 26.96,12.03 27.48,11.51 arc-90 27.48,11.14 27.39,11.05 arc-90 27.01,11.05 26.95,11.12 arc90 26.57,11.12 v25.76,10.31
TX0_P  (via drill 0.33)
  Top 0.152: v40.95,11.44 42.33,12.81 HDMI_PROCESSOR.90 | v24.89,8.38 24.51,8.38 24.39,8.25 23.45,8.25 HDMI_HEADER.7
  Bottom 0.152: v40.95,11.44 35.51,6 21.76,6 21.32,6.44 21.32,6.81 22.89,8.38 v24.89,8.38
TX1_N
  Top 0.152: HDMI_PROCESSOR.86 41.01,14.31 41.01,14.5 41.51,15 41.51,15.56 38.33,18.75 36.08,18.75 31.51,14.19 arc90 31.51,13.81 31.79,13.53 arc-90 31.79,13.15 31.63,12.98 arc-90 31.25,12.98 30.31,13.93 arc90 29.93,13.93 29.76,13.76 arc90 29.76,13.38 30.71,12.44 arc-90 30.71,12.06 30.54,11.89 arc-90 30.16,11.89 29.88,12.18 arc90 29.5,12.18 25.07,7.75 23.45,7.75 HDMI_HEADER.6
TX1_P  (via drill 0.33)
  Top 0.152: v39.2,13.25 40.58,14.62 HDMI_PROCESSOR.85 | v21.95,6.62 23.32,6.62 23.39,6.69 HDMI_HEADER.4
  Bottom 0.152: v21.95,6.62 32.58,6.62 34.82,8.87 arc-90 35.2,8.87 35.39,8.68 arc90 35.77,8.68 35.8,8.71 arc90 35.8,9.09 35.04,9.85 arc-90 35.04,10.23 35.07,10.27 arc-90 35.45,10.27 36.22,9.5 arc90 36.59,9.5 36.63,9.54 arc90 36.63,9.91 35.86,10.68 arc-90 35.86,11.06 35.9,11.09 arc-90 36.28,11.09 37.04,10.33 arc90 37.42,10.33 37.46,10.36 arc90 37.46,10.74 37.26,10.94 arc-90 37.26,11.31 v39.2,13.25
TX2_N  (via drill 0.33)
  Top 0.152: v38.58,14.88 38.58,15.25 39.14,15.81 39.14,16 HDMI_PROCESSOR.81 | v26.7,8.5 24.45,6.25 23.45,6.25 HDMI_HEADER.3
  Bottom 0.152: v38.58,14.88 38.58,15.44 38.01,16 34.2,16 33.26,15.06 arc90 33.26,14.69 33.32,14.63 arc-90 33.32,14.25 33.32,14.25 arc-90 32.94,14.25 32.45,14.74 arc90 32.07,14.74 32.07,14.74 arc90 32.07,14.36 32.56,13.87 arc-90 32.56,13.49 32.56,13.49 arc-90 32.18,13.49 31.69,13.98 arc90 31.31,13.98 31.31,13.98 arc90 31.31,13.6 31.8,13.11 arc-90 31.8,12.73 31.8,12.73 arc-90 31.42,12.73 30.93,13.22 arc90 30.55,13.22 30.55,13.22 arc90 30.55,12.84 31.04,12.35 arc-90 31.04,11.97 31.04,11.97 arc-90 30.66,11.97 30.17,12.46 arc90 29.79,12.46 29.79,12.46 arc90 29.79,12.08 30.28,11.59 arc-90 30.28,11.21 30.28,11.21 arc-90 29.9,11.21 29.84,11.27 arc90 29.47,11.27 v26.7,8.5
TX2_P  (via drill 0.33)
  Top 0.152: v37.83,15.38 38.83,16.38 HDMI_PROCESSOR.80 | v26.7,7.25 26.39,7.25 24.39,5.25 23.45,5.25 HDMI_HEADER.1
  Bottom 0.152: v37.83,15.38 34.95,12.5 arc90 34.95,12.12 34.99,12.09 arc-90 34.99,11.71 34.98,11.7 arc-90 34.6,11.7 34.15,12.15 arc90 33.77,12.15 33.76,12.14 arc90 33.76,11.76 34.21,11.31 arc-90 34.21,10.94 34.2,10.93 arc-90 33.83,10.93 33.38,11.38 arc90 33,11.38 32.99,11.37 arc90 32.99,10.99 33.44,10.54 arc-90 33.44,10.16 33.43,10.15 arc-90 33.05,10.15 32.6,10.61 arc90 32.23,10.61 32.22,10.6 arc90 32.22,10.22 32.67,9.77 arc-90 32.67,9.39 32.66,9.38 arc-90 32.28,9.38 31.83,9.83 arc90 31.45,9.83 31.45,9.82 arc90 31.45,9.45 31.9,8.99 arc-90 31.9,8.62 31.89,8.61 arc-90 31.51,8.61 31.06,9.06 arc90 30.68,9.06 30.67,9.05 arc90 30.67,8.67 31.12,8.22 arc-90 31.12,7.85 31.11,7.84 arc-90 30.74,7.84 30.7,7.87 arc90 30.32,7.87 29.7,7.25 v26.7,7.25
TXCLK_N  (via drill 0.33)
  Top 0.152: v42.95,10.5 43.76,11.31 43.76,11.44 HDMI_PROCESSOR.94 | v30.57,16.94 27.84,14.21 arc-90 27.47,14.21 27.38,14.29 arc90 27,14.29 26.84,14.13 arc90 26.84,13.76 27.39,13.21 arc-90 27.39,12.83 27.23,12.67 arc-90 26.86,12.67 26.31,13.22 arc90 25.93,13.22 25.77,13.06 arc90 25.77,12.68 25.86,12.6 arc-90 25.86,12.22 24.39,10.75 23.45,10.75 HDMI_HEADER.12
  Bottom 0.152: v42.95,10.5 42.95,12.38 38.39,16.94 v30.57,16.94
TXCLK_P  (via drill 0.33)
  Top 0.152: v42.08,10.44 43.39,11.75 HDMI_PROCESSOR.93 | v24.89,10.25 24.39,9.75 23.45,9.75 HDMI_HEADER.10
  Bottom 0.152: v42.08,10.44 42.08,10.94 42.51,11.38 42.51,12.38 38.26,16.62 31.2,16.62 29.95,15.38 28.51,15.38 27.41,14.27 arc-90 27.03,14.27 26.7,14.6 arc90 26.32,14.6 26.27,14.56 arc90 26.27,14.18 26.61,13.85 arc-90 26.61,13.47 24.89,11.75 v24.89,10.25
VSYNC
  Top 0.254: LCD_HEADER.P$8 86.89,6.56 84.7,8.75 83.45,8.75 83.2,9 83.2,10.85 RN7.7

### Text on the board
_tsilk: HDMI CAPTOUCH LCD | 2014-07-04 (v2.4) | chris@knights.ucf.edu